# Altium schematic sheet 手电钻驱动板V.SchDoc
size A4
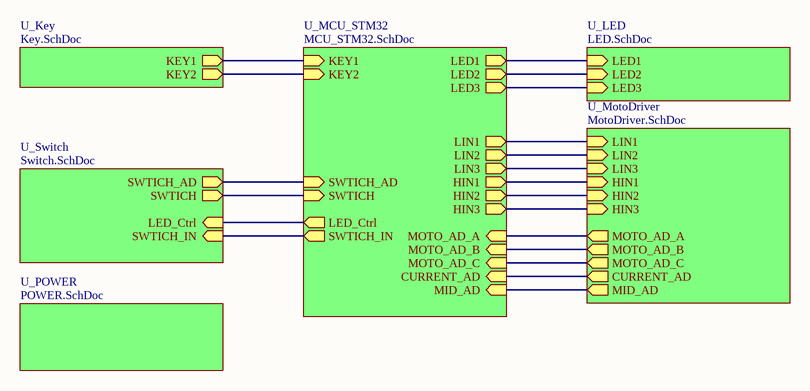
[diagram p0: 手电钻驱动板V.SchDoc]

## Sub-sheets
U_Key = Key.SchDoc: KEY1 (out), KEY2 (out)
U_LED = LED.SchDoc: LED1 (in), LED2 (in), LED3 (in)
U_MCU_STM32 = MCU_STM32.SchDoc: MOTO_AD_A (in), MOTO_AD_B (in), MOTO_AD_C (in), LIN1 (out), LIN2 (out), LIN3 (out), HIN1 (out), HIN2 (out), HIN3 (out), MID_AD (in), CURRENT_AD (in), LED_Ctrl (out), SWTICH_AD (in), SWTICH_IN (out), SWTICH (in), LED1 (out), LED2 (out), LED3 (out), KEY1 (in), KEY2 (in)
U_MotoDriver = MotoDriver.SchDoc: LIN1 (in), LIN2 (in), LIN3 (in), HIN1 (in), HIN2 (in), HIN3 (in), MID_AD (out), CURRENT_AD (out), MOTO_AD_A (out), MOTO_AD_B (out), MOTO_AD_C (out)
U_POWER = POWER.SchDoc: no entries
U_Switch = Switch.SchDoc: LED_Ctrl (in), SWTICH_AD (out), SWTICH_IN (in), SWTICH (out)

## Nets
(unnamed): sheet U_Key/KEY1, sheet U_MCU_STM32/KEY1
(unnamed): sheet U_Key/KEY2, sheet U_MCU_STM32/KEY2
(unnamed): sheet U_LED/LED1, sheet U_MCU_STM32/LED1
(unnamed): sheet U_LED/LED2, sheet U_MCU_STM32/LED2
(unnamed): sheet U_LED/LED3, sheet U_MCU_STM32/LED3
(unnamed): sheet U_MCU_STM32/MOTO_AD_A, sheet U_MotoDriver/MOTO_AD_A
(unnamed): sheet U_MCU_STM32/MOTO_AD_B, sheet U_MotoDriver/MOTO_AD_B
(unnamed): sheet U_MCU_STM32/MOTO_AD_C, sheet U_MotoDriver/MOTO_AD_C
(unnamed): sheet U_MCU_STM32/LIN1, sheet U_MotoDriver/LIN1
(unnamed): sheet U_MCU_STM32/LIN2, sheet U_MotoDriver/LIN2
(unnamed): sheet U_MCU_STM32/LIN3, sheet U_MotoDriver/LIN3
(unnamed): sheet U_MCU_STM32/HIN1, sheet U_MotoDriver/HIN1
(unnamed): sheet U_MCU_STM32/HIN2, sheet U_MotoDriver/HIN2
(unnamed): sheet U_MCU_STM32/HIN3, sheet U_MotoDriver/HIN3
(unnamed): sheet U_MCU_STM32/MID_AD, sheet U_MotoDriver/MID_AD
(unnamed): sheet U_MCU_STM32/CURRENT_AD, sheet U_MotoDriver/CURRENT_AD
(unnamed): sheet U_MCU_STM32/LED_Ctrl, sheet U_Switch/LED_Ctrl
(unnamed): sheet U_MCU_STM32/SWTICH_AD, sheet U_Switch/SWTICH_AD
(unnamed): sheet U_MCU_STM32/SWTICH_IN, sheet U_Switch/SWTICH_IN
(unnamed): sheet U_MCU_STM32/SWTICH, sheet U_Switch/SWTICH